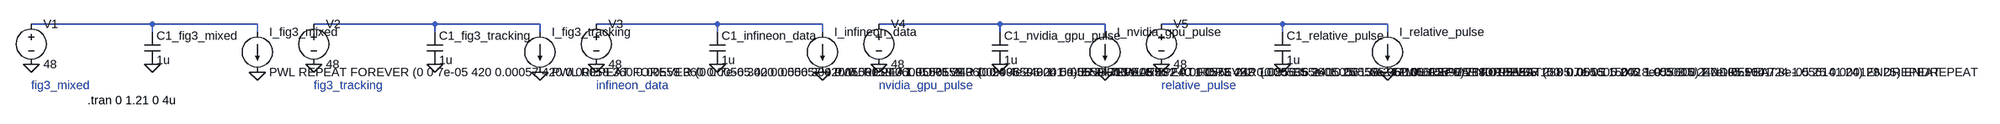
[diagram p0: schematic all_profiles.asc]
all_profiles.asc, the LTspice schematic file:
Version 4
SHEET 1 3200 680
WIRE -176 128 272 128
WIRE 64 144 64 128
WIRE 272 144 272 128
FLAG -176 208 0
FLAG 272 224 0
FLAG 64 208 0
SYMBOL cap 48 144 R0
SYMATTR InstName C1_fig3_mixed
SYMATTR Value 1u
SYMBOL current 272 144 R0
SYMATTR InstName I_fig3_mixed
SYMATTR Value PWL REPEAT FOREVER (0 0 7e-05 420 0.00057 420 0.00058 360 0.00558 360 0.0056 300 0.0556 300 0.05561 240 1.05561 240 1.09996 240 1.1 0) ENDREPEAT
SYMBOL voltage -176 112 R0
WINDOW 123 0 0 Left 0
WINDOW 39 0 0 Left 0
SYMATTR InstName V1
SYMATTR Value 48
TEXT -176 250 Left 2 ;fig3_mixed
WIRE 384 128 832 128
WIRE 624 144 624 128
WIRE 832 144 832 128
FLAG 384 208 0
FLAG 832 224 0
FLAG 624 208 0
SYMBOL cap 608 144 R0
SYMATTR InstName C1_fig3_tracking
SYMATTR Value 1u
SYMBOL current 832 144 R0
SYMATTR InstName I_fig3_tracking
SYMATTR Value PWL REPEAT FOREVER (0 0 7e-05 420 0.00057 420 0.00058 360 0.00558 360 0.00559 300 0.05559 300 0.0556 240 1.0556 240 1.055636 24 1.056136 24 1.056137 0) ENDREPEAT
SYMBOL voltage 384 112 R0
WINDOW 123 0 0 Left 0
WINDOW 39 0 0 Left 0
SYMATTR InstName V2
SYMATTR Value 48
TEXT 384 250 Left 2 ;fig3_tracking
WIRE 944 128 1392 128
WIRE 1184 144 1184 128
WIRE 1392 144 1392 128
FLAG 944 208 0
FLAG 1392 224 0
FLAG 1184 208 0
SYMBOL cap 1168 144 R0
SYMATTR InstName C1_infineon_data
SYMATTR Value 1u
SYMBOL current 1392 144 R0
SYMATTR InstName I_infineon_data
SYMATTR Value PWL REPEAT FOREVER (0 24 4e-06 24 5e-06 24 7.3e-05 432 0.000573 432 0.000585 360 0.005585 360 0.005597 288 0.055597 288 0.055605 240 1.055605 240 1.055641 24 1.056141 24) ENDREPEAT
SYMBOL voltage 944 112 R0
WINDOW 123 0 0 Left 0
WINDOW 39 0 0 Left 0
SYMATTR InstName V3
SYMATTR Value 48
TEXT 944 250 Left 2 ;infineon_data
WIRE 1504 128 1952 128
WIRE 1744 144 1744 128
WIRE 1952 144 1952 128
FLAG 1504 208 0
FLAG 1952 224 0
FLAG 1744 208 0
SYMBOL cap 1728 144 R0
SYMATTR InstName C1_nvidia_gpu_pulse
SYMATTR Value 1u
SYMBOL current 1952 144 R0
SYMATTR InstName I_nvidia_gpu_pulse
SYMATTR Value PWL REPEAT FOREVER (0 25 1.55e-05 25 1.6e-05 100 1.8e-05 180 1.9e-05 150 5.7e-05 150 5.8e-05 100 7.7e-05 100 7.8e-05 25 0.000128 25) ENDREPEAT
SYMBOL voltage 1504 112 R0
WINDOW 123 0 0 Left 0
WINDOW 39 0 0 Left 0
SYMATTR InstName V4
SYMATTR Value 48
TEXT 1504 250 Left 2 ;nvidia_gpu_pulse
WIRE 2064 128 2512 128
WIRE 2304 144 2304 128
WIRE 2512 144 2512 128
FLAG 2064 208 0
FLAG 2512 224 0
FLAG 2304 208 0
SYMBOL cap 2288 144 R0
SYMATTR InstName C1_relative_pulse
SYMATTR Value 1u
SYMBOL current 2512 144 R0
SYMATTR InstName I_relative_pulse
SYMATTR Value PWL REPEAT FOREVER (0 0 0.001 1 0.002 1 0.003 0) ENDREPEAT
SYMBOL voltage 2064 112 R0
WINDOW 123 0 0 Left 0
WINDOW 39 0 0 Left 0
SYMATTR InstName V5
SYMATTR Value 48
TEXT 2064 250 Left 2 ;relative_pulse
TEXT -64 280 Left 2 !.tran 0 1.21 0 4u

The netlist it stands for:
* all_profiles.asc
C1_fig3_mixed N001 0 1u
I_fig3_mixed N001 0 PWL REPEAT FOREVER (0 0 7e-05 420 0.00057 420 0.00058 360 0.00558 360 0.0056 300 0.0556 300 0.05561 240 1.05561 240 1.09996 240 1.1 0) ENDREPEAT
V1 N001 0 48
C1_fig3_tracking N002 0 1u
I_fig3_tracking N002 0 PWL REPEAT FOREVER (0 0 7e-05 420 0.00057 420 0.00058 360 0.00558 360 0.00559 300 0.05559 300 0.0556 240 1.0556 240 1.055636 24 1.056136 24 1.056137 0) ENDREPEAT
V2 N002 0 48
C1_infineon_data N003 0 1u
I_infineon_data N003 0 PWL REPEAT FOREVER (0 24 4e-06 24 5e-06 24 7.3e-05 432 0.000573 432 0.000585 360 0.005585 360 0.005597 288 0.055597 288 0.055605 240 1.055605 240 1.055641 24 1.056141 24) ENDREPEAT
V3 N003 0 48
C1_nvidia_gpu_pulse N004 0 1u
I_nvidia_gpu_pulse N004 0 PWL REPEAT FOREVER (0 25 1.55e-05 25 1.6e-05 100 1.8e-05 180 1.9e-05 150 5.7e-05 150 5.8e-05 100 7.7e-05 100 7.8e-05 25 0.000128 25) ENDREPEAT
V4 N004 0 48
C1_relative_pulse N005 0 1u
I_relative_pulse N005 0 PWL REPEAT FOREVER (0 0 0.001 1 0.002 1 0.003 0) ENDREPEAT
V5 N005 0 48
* fig3_mixed
* fig3_tracking
* infineon_data
* nvidia_gpu_pulse
* relative_pulse
.tran 0 1.21 0 4u
.backanno
.end